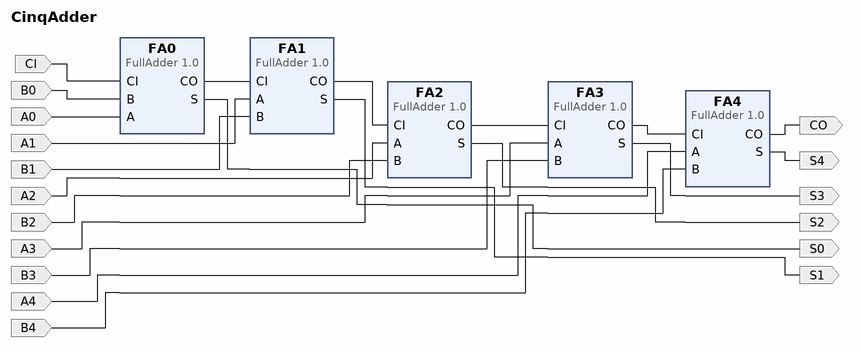
[diagram p0: block diagram of the top level]
# Vivado block design CinqAdder, xc7a35tcpg236-1, Vivado 2017.2
create_bd_design CinqAdder

create_bd_port -dir I A0
create_bd_port -dir I A1
create_bd_port -dir I A2
create_bd_port -dir I A3
create_bd_port -dir I A4
create_bd_port -dir I B0
create_bd_port -dir I CI
create_bd_port -dir I B1
create_bd_port -dir I B2
create_bd_port -dir I B3
create_bd_port -dir I B4
create_bd_port -dir O S0
create_bd_port -dir O S1
create_bd_port -dir O S2
create_bd_port -dir O S3
create_bd_port -dir O S4
create_bd_port -dir O CO

create_bd_cell -type ip -vlnv xilinx.com:user:FullAdder:1.0 FA0
create_bd_cell -type ip -vlnv xilinx.com:user:FullAdder:1.0 FA1
create_bd_cell -type ip -vlnv xilinx.com:user:FullAdder:1.0 FA2
create_bd_cell -type ip -vlnv xilinx.com:user:FullAdder:1.0 FA3
create_bd_cell -type ip -vlnv xilinx.com:user:FullAdder:1.0 FA4

# ---- connections ----

connect_bd_net [get_bd_ports CI] [get_bd_pins FA0/CI]
connect_bd_net -net B0_1 [get_bd_ports B0] [get_bd_pins FA0/B]
connect_bd_net -net A0_1 [get_bd_ports A0] [get_bd_pins FA0/A]
connect_bd_net -net A1_1 [get_bd_ports A1] [get_bd_pins FA1/A]
connect_bd_net -net B1_1 [get_bd_ports B1] [get_bd_pins FA1/B]
connect_bd_net -net A2_1 [get_bd_ports A2] [get_bd_pins FA2/A]
connect_bd_net -net B2_1 [get_bd_ports B2] [get_bd_pins FA2/B]
connect_bd_net -net A3_1 [get_bd_ports A3] [get_bd_pins FA3/A]
connect_bd_net -net B3_1 [get_bd_ports B3] [get_bd_pins FA3/B]
connect_bd_net -net A4_1 [get_bd_ports A4] [get_bd_pins FA4/A]
connect_bd_net -net B4_1 [get_bd_ports B4] [get_bd_pins FA4/B]
connect_bd_net [get_bd_pins FA3/CO] [get_bd_pins FA4/CI]
connect_bd_net [get_bd_pins FA2/CO] [get_bd_pins FA3/CI]
connect_bd_net [get_bd_pins FA1/CO] [get_bd_pins FA2/CI]
connect_bd_net [get_bd_pins FA0/CO] [get_bd_pins FA1/CI]
connect_bd_net [get_bd_pins FA4/S] [get_bd_ports S4]
connect_bd_net [get_bd_pins FA3/S] [get_bd_ports S3]
connect_bd_net [get_bd_pins FA2/S] [get_bd_ports S2]
connect_bd_net [get_bd_pins FA1/S] [get_bd_ports S1]
connect_bd_net [get_bd_pins FA0/S] [get_bd_ports S0]
connect_bd_net [get_bd_pins FA4/CO] [get_bd_ports CO]

validate_bd_design
save_bd_design
